# Altium schematic sheet Sheet1.SchDoc
size A4
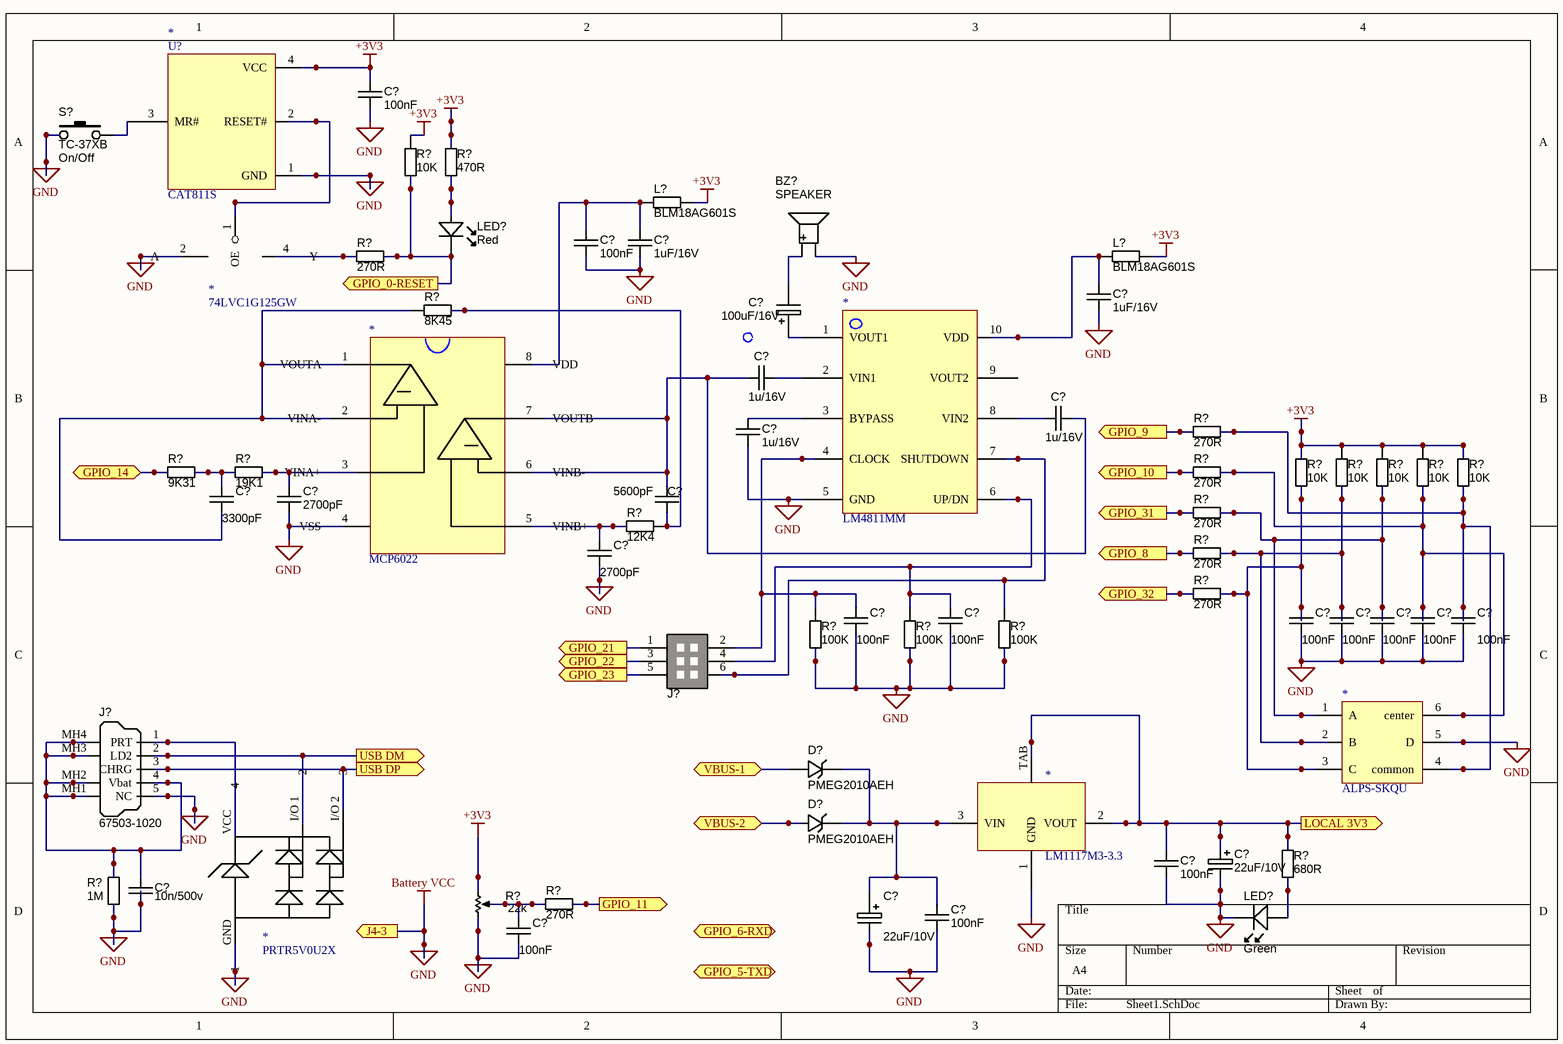
[diagram p0: Sheet1.SchDoc]

## Parts
(Parts that share a designator on the sheet are numbered #1, #2 ... from top to bottom, then left to right.)
*#1  CAT811S  [SOT-143-RC4_N]
*#2  74LVC1G125GW  [SOT-23-CT5_N]
*#3  MCP6022  [MSOP-UA8_L]
*#4  LM4811MM  [MSOP-UN10_N]
*#5  ALPS-SKQU  [SOT-23-CH6_L]
*#6  LM1117M3-3.3  [SOT-89-MB3_M]
*#7  PRTR5V0U2X  [SOT-143-RC4_N]
BZ?  Manufacturer Part Number 1: SPEAKER  [BUZZER_12.0X8.5MM]  (hidden comment: Alternate part: 3100-932)
C?#1  value 100nF  [CAPC2012N]  (hidden comment: approved sub OK)
C?#2  value 100nF  [CAPC2012N]  (hidden comment: approved sub OK)
C?#3  value 1uF/16V  [CAPC2012N]  (hidden comment: approved sub OK)
C?#4  value 1uF/16V  [CAPC2012N]  (hidden comment: approved sub OK)
C?#5  (no value)  [CAPMP3528X210N]
C?#6  value 1u/16V  [CAPC2012N]  (hidden comment: approved sub OK)
C?#7  value 1u/16V  [CAPC2012N]  (hidden comment: approved sub OK)
C?#8  value 1u/16V  [CAPC2012N]  (hidden comment: approved sub OK)
C?#9  value 3300pF  [CAPC2012N]  (hidden comment: approved sub OK)
C?#10  value 2700pF  [CAPC2012N]  (hidden comment: approved sub OK)
C?#11  value 5600pF  [CAPC2012N]  (hidden comment: approved sub OK)
C?#12  value 2700pF  [CAPC2012N]  (hidden comment: approved sub OK)
C?#13  value 100nF  [CAPC2012N]  (hidden comment: approved sub OK)
C?#14  value 100nF  [CAPC2012N]  (hidden comment: approved sub OK)
C?#15  value 100nF  [CAPC2012N]  (hidden comment: approved sub OK)
C?#16  value 100nF  [CAPC2012N]  (hidden comment: approved sub OK)
C?#17  value 100nF  [CAPC2012N]  (hidden comment: approved sub OK)
C?#18  value 100nF  [CAPC2012N]  (hidden comment: approved sub OK)
C?#19  value 100nF  [CAPC2012N]  (hidden comment: approved sub OK)
C?#20  value 100nF  [CAPC2012N]  (hidden comment: approved sub OK)
C?#21  (no value)  [CAPMP3528X210N]
C?#22  value 10n/500v  [CAPC2012N]  (hidden comment: approved sub OK)
C?#23  (no value)  [CAPMP3528X210N]
C?#24  value 100nF  [CAPC2012N]  (hidden comment: approved sub OK)
C?#25  value 100nF  [CAPC2012N]  (hidden comment: approved sub OK)
D?#1  PMEG2010AEH  [SOD323]
D?#2  PMEG2010AEH  [SOD323]
J?#1  micro-match socket  [6P_PCB_SOCKET_BRD_MNT_MICRO-MATCH]  (value not drawn)
J?#2  Manufacturer Part Number 1: 67503-1020  [USB_Mini-B_Molex_SMT]  (hidden comment: USB_Mini-B)
L?#1  value BLM18AG601S  [RESC2012N]  (hidden comment: Thick Film)
L?#2  value BLM18AG601S  [RESC2012N]  (hidden comment: Thick Film)
LED?#1  Red  [LED-0805-A]
LED?#2  Green  [LED-0805-K]
R?#1  value 10K  [RESC2012N]  (hidden comment: Thick Film)
R?#2  value 470R  [RESC1608N]  (hidden comment: Thick Film)
R?#3  value 270R  [RESC1005N]  (hidden comment: Thick Film)
R?#4  value 8K45  [RESC1005N]  (hidden comment: Thick Film)
R?#5  value 270R  [RESC1005N]  (hidden comment: Thick Film)
R?#6  value 9K31  [RESC1005N]  (hidden comment: Thick Film)
R?#7  value 19K1  [RESC1005N]  (hidden comment: Thick Film)
R?#8  value 270R  [RESC1005N]  (hidden comment: Thick Film)
R?#9  value 10K  [RESC2012N]  (hidden comment: Thick Film)
R?#10  value 10K  [RESC2012N]  (hidden comment: Thick Film)
R?#11  value 10K  [RESC2012N]  (hidden comment: Thick Film)
R?#12  value 10K  [RESC2012N]  (hidden comment: Thick Film)
R?#13  value 10K  [RESC2012N]  (hidden comment: Thick Film)
R?#14  value 270R  [RESC1005N]  (hidden comment: Thick Film)
R?#15  value 12K4  [RESC1005N]  (hidden comment: Thick Film)
R?#16  value 270R  [RESC1005N]  (hidden comment: Thick Film)
R?#17  value 270R  [RESC1005N]  (hidden comment: Thick Film)
R?#18  value 100K  [RESC1005N]  (hidden comment: Thick Film)
R?#19  value 100K  [RESC1005N]  (hidden comment: Thick Film)
R?#20  value 100K  [RESC1005N]  (hidden comment: Thick Film)
R?#21  value 680R  [RESC1005N]  (hidden comment: Thick Film)
R?#22  value 1M  [RESC1005N]  (hidden comment: Thick Film)
R?#23  value 22k  [TrimPot_SMD_Bourns_3214G]
R?#24  value 270R  [RESC1005N]  (hidden comment: Thick Film)
S?  Manufacturer Part Number 1: TC-37XB  Function: On/Off  [TACT-SWITCH-TC-37XB]  (hidden comment: SW_THT_PB_5.0mm)

## Ports
GPIO_0-RESET (out), GPIO_5-TXD, GPIO_6-RXD, GPIO_8 (out), GPIO_9 (out), GPIO_10 (out), GPIO_11 (out), GPIO_14, GPIO_21 (out), GPIO_22 (out), GPIO_23 (out), GPIO_31 (out), GPIO_32 (out), J4-3 (out), LOCAL 3V3 (out), USB DM (out), USB DP (out), VBUS-1, VBUS-2

## Nets
+3V3: *#1.4(VCC) C?#1.1 L?#1.2 L?#2.2 R?#1.1 R?#2.1 R?#9.1 R?#10.1 R?#11.1 R?#12.1 R?#13.1 R?#23.3(CW)
Battery VCC: *#1.1(GND) *#4.5(GND) *#5.5(D) *#6.1(GND) BZ?.2(Negative) C?#1.2 C?#2.1 C?#3.1 C?#4.1 C?#8.1 C?#10.2 C?#12.2 C?#13.2 C?#14.2 C?#15.2 C?#16.2 C?#17.2 C?#18.2 C?#19.2 C?#20.1 C?#21.2 C?#22.2 C?#23.2 C?#24.1 C?#25.2 J?#2.5(NC) LED?#2.K R?#18.1 R?#19.1 R?#20.1 R?#22.1 R?#23.1(CCW) S?.1 ; port J4-3  [also labelled GND]
GPIO_0-RESET: LED?#1.K R?#1.2 R?#3.2 ; port GPIO_0-RESET
GPIO_8: R?#16.1 ; port GPIO_8
GPIO_9: R?#5.1 ; port GPIO_9
GPIO_10: R?#8.1 ; port GPIO_10
GPIO_11: R?#24.2 ; port GPIO_11
GPIO_14: R?#6.1 ; port GPIO_14
GPIO_21: J?#1.1 ; port GPIO_21
GPIO_22: J?#1.3 ; port GPIO_22
GPIO_23: J?#1.5 ; port GPIO_23
GPIO_31: R?#14.1 ; port GPIO_31
GPIO_32: R?#17.1 ; port GPIO_32
LOCAL 3V3: *#6.2(VOUT) *#6.TAB C?#20.2 C?#21.1 R?#21.2 ; port LOCAL 3V3
USB DM: *#7.I/O_1(2) J?#2.2(LD2) ; port USB DM
USB DP: J?#2.3(CHRG) ; port USB DP
VBUS-1: D?#1.A ; port VBUS-1
VBUS-2: D?#2.A ; port VBUS-2
Net*#1_2: *#1.2(RESET#) *#2.1(OE)
Net*#1_3: *#1.3(MR#) S?.2
Net*#4_1: *#4.1(VOUT1) C?#5.1
Net*#4_2: *#4.2(VIN1) C?#6.2
Net*#4_3: *#4.3(BYPASS) C?#8.2
Net*#4_4: *#4.4(CLOCK) C?#13.1 J?#1.2 R?#18.2
Net*#4_6: *#4.6(UP/DN) C?#14.1 J?#1.4 R?#19.2
Net*#4_7: *#4.7(SHUTDOWN) J?#1.6 R?#20.2
Net*#4_8: *#4.8(VIN2) C?#7.1
Net*#4_10: *#4.10(VDD) C?#4.2 L?#2.1
Net*#5_1: *#5.1(A) C?#17.1 R?#11.2 R?#14.2
Net*#5_2: *#5.2(B) C?#16.1 R?#10.2 R?#16.2
Net*#5_3: *#5.3(C) C?#15.1 R?#9.2 R?#17.2
Net*#5_4: *#5.4(common) C?#19.1 R?#5.2 R?#13.2
Net*#5_6: *#5.6(center) C?#18.1 R?#8.2 R?#12.2
Net*#6_3: *#6.3(VIN) C?#23.1 C?#24.2 D?#1.K D?#2.K
Net*#7_VCC: *#7.VCC(4) J?#2.1(PRT)
NetBZ?_1: BZ?.1(Positive) C?#5.2
NetC?#2_2: C?#2.2 C?#3.2 L?#1.1
NetC?#6_1: C?#6.1 C?#7.2 C?#11.1
NetC?#9_1: C?#9.1 R?#6.2 R?#7.1
NetC?#9_2: C?#9.2 R?#4.2
NetC?#10_1: C?#10.1 R?#7.2
NetC?#11_2: C?#11.2 R?#4.1 R?#15.2
NetC?#12_1: C?#12.1 R?#15.1
NetC?#22_1: C?#22.1 J?#2.4(Vbat) J?#2.MH1(Shell) J?#2.MH2(Shell) J?#2.MH3(Shell) J?#2.MH4(Shell) R?#22.2
NetC?#25_1: C?#25.1 R?#23.2(WIPER) R?#24.1
NetLED?#1_A: LED?#1.A R?#2.2
NetLED?#2_A: LED?#2.A R?#21.1

Not connected (* = marked no-connect by the designer): *#2 2(A) 4(Y); *#3 1(VOUTA) 2(VINA-) 3(VINA+) 4(VSS) 5(VINB+) 6(VINB-) 7(VOUTB) 8(VDD); *#4 9(VOUT2); *#7 GND(1) I/O 2(3); R?#3 1

## Notes on the sheet
- (in symbol CAPT_100u_1210_6V3) 100uF/16V; 22uF/10V
- (in symbol CAT811S) U?

## Library data of the parts
BZ? = BZ_12x8.5x6.5_2kHz: Speaker, Magnetic Transducer; Manufacturer 1: CUI Inc; Ratings: 2048 ?00 Hz; Package / Case: 6.5mm pitch; Material: Noryl SE1-J; Supplier 1: Digi-Key; Supplier Part Number 1: 102-1152-ND
C?#1-C?#4 C?#6-C?#20 C?#22 C?#24 C?#25 = CAPC_100n_0805: Capacitor SMD Cer 100nF 10% 50V X7R 0805; Manufacturer 1: Kemet; Manufacturer Part Number 1: C0805C104K5RACTU; Tolerance: ?0%; Ratings: 50V; X7R; Material: ceramic; Package / Case: 0805 (2012 metric); Supplier 1: Digi-Key; Supplier Part Number 1: 399-1170-1-ND
C?#5 C?#21 C?#23 = CAPT_100u_1210_6V3: Capacitor SMD Tantalum 100uF 20% 6.3V 1210; Manufacturer 1: AVX Corporation; Manufacturer Part Number 1: TCJB107M006R0045; Tolerance: ?0%; Package / Case: 1210 (3528 Metric); Material: Tantalum; Supplier 1: Digi-Key; Supplier Part Number 1: 478-4711-1-ND
D?#1 D?#2 = DIODE_ZENER_3V3_SOD323: Diode Zener SMD 3.3V 200mW SOD-323; Manufacturer 1: ON Semiconductor; Manufacturer Part Number 1: MM3Z3V3ST1G; Ratings: 3.3V; 0.2W; Vf=900mV @ 10mA; Material: Si; Tolerance: ?%; Package / Case: SOD-323; Diode Type: Zener; Supplier 1: Digi-Key; Supplier Part Number 1: MM3Z3V3ST1GOSCT-ND
J?#1 = CONN_SOCKET_2x3P_0.100in_Female: Socket THD 6 POS Double-row 2.54mm pitch; Manufacturer 1: TE Connectivity; Manufacturer Part Number 1: 7-215079-6; Pitch: 0.100" (2.54mm); Value: Double-row, 14 positions; QtyOverride: 1; Connector Type: Receptacle; Number of Positions: 6; Package / Case: Connector header; 2.54mm pitch; Contact Type: Female Socket; Number of Rows: 2; Row Spacing: 0.100" (2.54mm); Contact Mating Length: 0.243" (6.17mm); ComponentLink1URL: http://multimedia.3m.com/mws/mediawebserver?66666UuZjcFSLXTtm8T_oxMcEVuQEcuZgVs6EVs6E666666--; ComponentLink1Description: http://multimedia.3m.com/mws/mediawebserver?66666UuZjcFSLXTtm8T_oxMcEVuQEcuZgVs6EVs6E666666--; Supplier 1: Digi-Key; Supplier Part Number 1: A30729CT-ND
J?#2 = USB_Mini-B: Connector SMD USB Type Mini-B; Manufacturer 1: Molex Connector Corporation; Package / Case: SMD; Supplier 1: Digi-Key; Supplier Part Number 1: WM5461CT-ND
L?#1 L?#2 R?#1 R?#9-R?#13 = RES_10K_0805_5%: Resistor SMD chip 10k Ohm 0.125W 5% 0805; Manufacturer 1: Yageo; Manufacturer Part Number 1: RC0805JR-0710KL; Ratings: 1/8 W; Tolerance: ?%; Package / Case: 0805 (2012 metric); Material: Thick Film; Supplier 1: Digi-Key; Supplier Part Number 1: 311-10KARCT-ND
LED?#1 = LED_SMD_Red_0805: LED, 0805 SMD, Red; Manufacturer 1: Ligitek; Manufacturer Part Number 1: LG170SR-CT; Material: GaAIAs; Ratings: 20 mcd; 643 nm; Package / Case: 0805
LED?#2 = LED_SMD_Green_0805_8mcd: LED, 0805 SMD, Green; Manufacturer 1: Ligitek; Manufacturer Part Number 1: LG-170PG-CT; Material: GaP; Ratings: 8 mcd; 558 nm; Package / Case: 0805
R?#2 = RES_470R_0603_5%: Resistor SMD chip 470 Ohm 0.1W 5% 0603; Manufacturer 1: Vishay/Dale; Manufacturer Part Number 1: CRCW0603470RJNEA; Ratings: 1/10 W; Tolerance: ?%; Package / Case: 0603 (1608 metric); Material: Thick Film; Supplier 1: Digi-Key; Supplier Part Number 1: 541-470GCT-ND
R?#3-R?#8 R?#14-R?#22 R?#24 = RES_330R_0402_5%: Resistor SMD chip 330 Ohm 0.063W 5% 0402; Manufacturer 1: Yageo; Manufacturer Part Number 1: RC0402JR-07330RL; Ratings: 1/16 W; Tolerance: ?%; Package / Case: 0402 (1005 Metric); Supplier 1: Digi-Key; Supplier Part Number 1: 311-330JRCT-ND; ComponentLink1URL: http://www.yageo.com/documents/recent/PYu-RC0402_51_RoHS_L_6.pdf; ComponentLink1Description: http://www.yageo.com/documents/recent/PYu-RC0402_51_RoHS_L_6.pdf
R?#23 = RES_TRIMMER_10K_5T_SMD: Trimmer SMD 10K 250mW 5-turn Side-adjust; Manufacturer 1: Bourns Inc.; Manufacturer Part Number 1: 3214G-1-103E; Tolerance: 10%; Ratings: 5 turn variable cermet; Number of Turns: 5; Supplier 1: Digi-Key; Supplier Part Number 1: 3214G-1-103ECT-ND
S? = SW_THT_PB_5.0mm: Switch, tact, 5.0mm stem; Manufacturer 1: Wealth Metal; Package / Case: 6.5x6.5mm; 5.0mm stem; Material: Brass/Nylon/Ag plating